# Altium project MotherBoard.PrjPcb
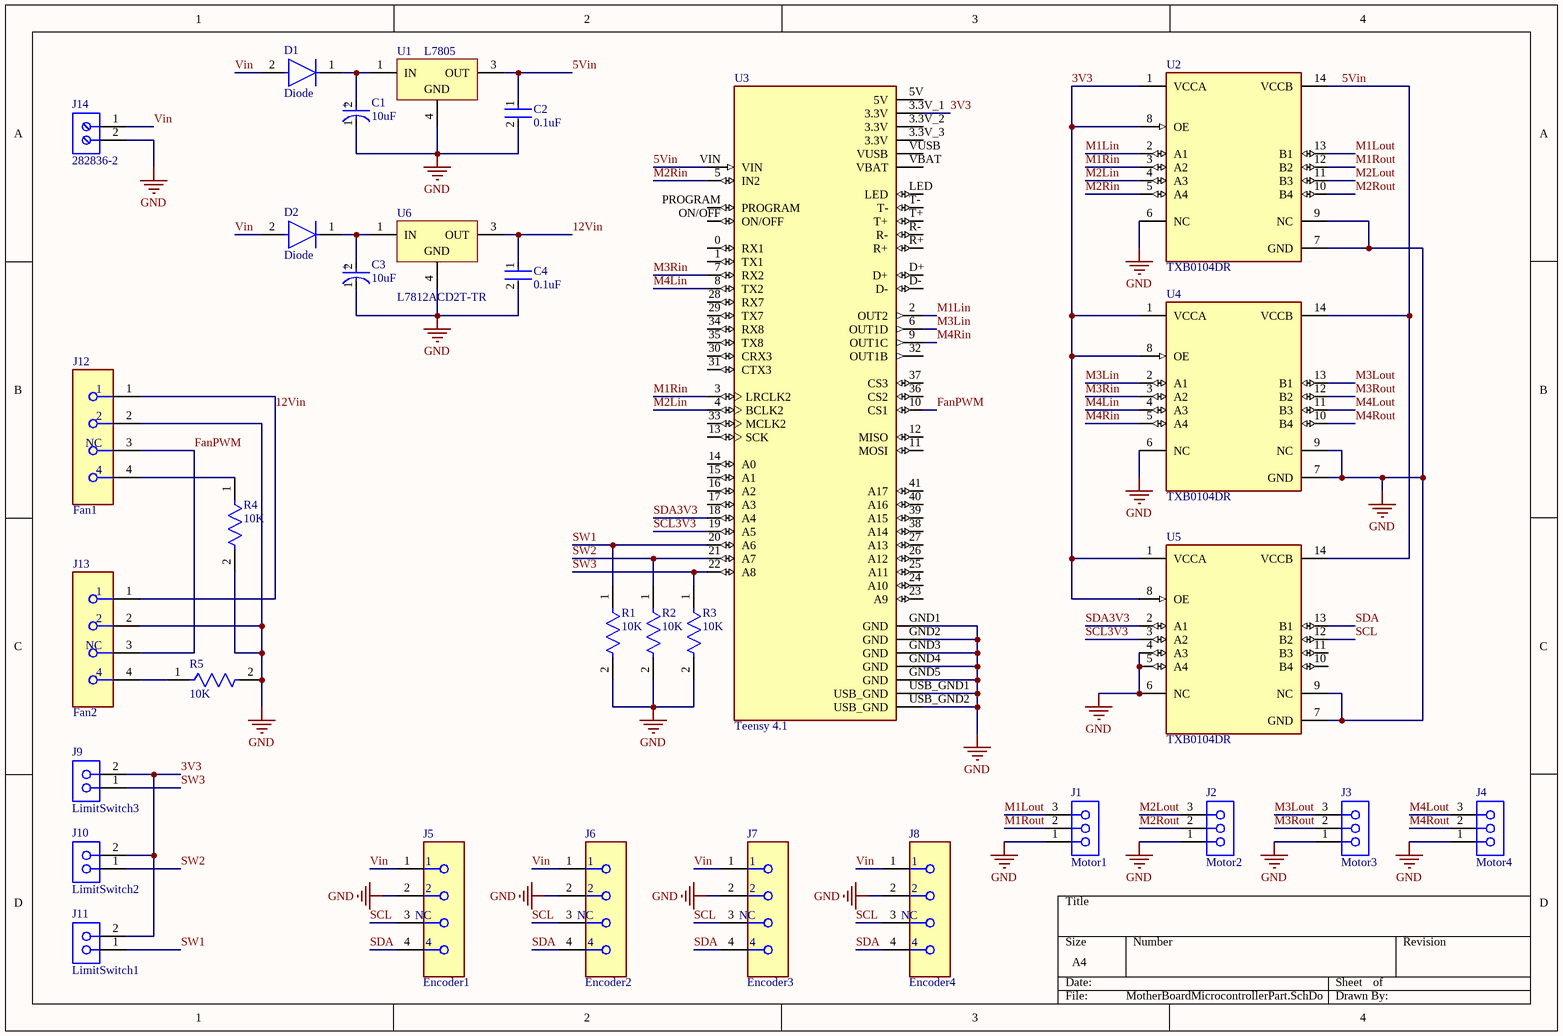
[diagram p0: MotherBoardMicrocontrollerPart.SchDoc]
1 sheet, 31 parts. Net scope: global (net labels, ports and power ports of the same name join across sheets).
Board file: MotherBoardPCB.PcbDoc

## Sheet MotherBoardMicrocontrollerPart.SchDoc
size A4; SheetNumber: 1; SheetTotal: 1

### Parts
C1  10uF  [FP-FKC-MFG]
C2  0.1uF  [FP-C322C104K5R5TA-MFG]
C3  10uF  [FP-FKC-MFG]
C4  0.1uF  [FP-C322C104K5R5TA-MFG]
D1  Diode  [FP-UF4007-MFG]
D2  Diode  [FP-UF4007-MFG]
J1  Motor1  [SMTC-BCS-103-X-S-TE]
J2  Motor2  [SMTC-BCS-103-X-S-TE]
J3  Motor3  [SMTC-BCS-103-X-S-TE]
J4  Motor4  [SMTC-BCS-103-X-S-TE]
J5  Encoder1  [FP-SSW-104-01-G-S-003-MFG]
J6  Encoder2  [FP-SSW-104-01-G-S-003-MFG]
J7  Encoder3  [FP-SSW-104-01-G-S-003-MFG]
J8  Encoder4  [FP-SSW-104-01-G-S-003-MFG]
J9  LimitSwitch3  [SMTC-SSW-102-02-X-S]
J10  LimitSwitch2  [SMTC-SSW-102-02-X-S]
J11  LimitSwitch1  [SMTC-SSW-102-02-X-S]
J12  Fan1  [FP-SSW-104-01-G-S-003-MFG]
J13  Fan2  [FP-SSW-104-01-G-S-003-MFG]
J14  282836-2  [TECO-282836-2_V]
R1  10K  [FP-RC3216-IPC_C]
R2  10K  [FP-RC3216-IPC_C]
R3  10K  [FP-RC3216-IPC_C]
R4  10K  [FP-RC3216-IPC_C]
R5  10K  [FP-RC3216-IPC_C]
U1  L7805  [TO-263_M]
U2  TXB0104DR  [FP-D0014A-MFG]
U3  Teensy 4.1  [MODULE_DEV-16771]
U4  TXB0104DR  [FP-D0014A-MFG]
U5  TXB0104DR  [FP-D0014A-MFG]
U6  L7812ACD2T-TR  [TO-263_M]

### Nets
GND: C1.1(C) C2.2 C3.1(C) C4.2 J1.1 J2.1 J3.1 J4.1 J5.2 J6.2 J7.2 J8.2 J12.2 J13.2 J14.2 R1.2 R2.2 R3.2 R4.2 R5.2 U1.4(GND) U2.6(NC) U2.7(GND) U2.9(NC) U3.GND1(GND) U3.GND2(GND) U3.GND3(GND) U3.GND4(GND) U3.GND5(GND) U3.USB_GND1(USB_GND) U3.USB_GND2(USB_GND) U4.6(NC) U4.7(GND) U4.9(NC) U5.4(A3) U5.5(A4) U5.6(NC) U5.7(GND) U5.9(NC) U6.4(GND)
3V3: J9.2 J10.2 J11.2 U2.1(VCCA) U2.8(OE) U3.3.3V_1(3.3V) U4.1(VCCA) U4.8(OE) U5.1(VCCA) U5.8(OE)
5Vin: C2.1 U1.3(OUT) U2.14(VCCB) U3.VIN U4.14(VCCB) U5.14(VCCB)
12Vin: C4.1 J12.1 J13.1 U6.3(OUT)
FanPWM: J12.3(NC) J13.3(NC) U3.10(CS1)
M1Lin: U2.2(A1) U3.2(OUT2)
M1Lout: J1.3 U2.13(B1)
M1Rin: U2.3(A2) U3.3(LRCLK2)
M1Rout: J1.2 U2.12(B2)
M2Lin: U2.4(A3) U3.4(BCLK2)
M2Lout: J2.3 U2.11(B3)
M2Rin: U2.5(A4) U3.5(IN2)
M2Rout: J2.2 U2.10(B4)
M3Lin: U3.6(OUT1D) U4.2(A1)
M3Lout: J3.3 U4.13(B1)
M3Rin: U3.7(RX2) U4.3(A2)
M3Rout: J3.2 U4.12(B2)
M4Lin: U3.8(TX2) U4.4(A3)
M4Lout: J4.3 U4.11(B3)
M4Rin: U3.9(OUT1C) U4.5(A4)
M4Rout: J4.2 U4.10(B4)
SCL: J5.3(NC) J6.3(NC) J7.3(NC) J8.3(NC) U5.12(B2)
SCL3V3: U3.19(A5) U5.3(A2)
SDA: J5.4 J6.4 J7.4 J8.4 U5.13(B1)
SDA3V3: U3.18(A4) U5.2(A1)
SW1: J11.1 R1.1 U3.20(A6)
SW2: J10.1 R2.1 U3.21(A7)
SW3: J9.1 R3.1 U3.22(A8)
Vin: D1.2(A) D2.2(A) J5.1 J6.1 J7.1 J8.1 J14.1
NetC1_2: C1.2(A) D1.1(C) U1.1(IN)
NetC3_2: C3.2(A) D2.1(C) U6.1(IN)
NetJ12_4: J12.4 R4.1
NetJ13_4: J13.4 R5.1

Not connected (* = marked no-connect by the designer): U3 0(RX1) 1(TX1) 3.3V_2(3.3V) 3.3V_3(3.3V) 5V 11(MOSI) 12(MISO) 13(SCK) 14(A0) 15(A1) 16(A2) 17(A3) 23(A9) 24(A10) 25(A11) 26(A12) 27(A13) 28(RX7) 29(TX7) 30(CRX3) 31(CTX3) 32(OUT1B) 33(MCLK2) 34(RX8) 35(TX8) 36(CS2) 37(CS3) 38(A14) 39(A15) 40(A16) 41(A17) D+ D- LED ON/OFF PROGRAM R+ R- T+ T- VBAT VUSB; U5 10(B4) 11(B3)

### Notes on the sheet
- (in symbol CMP-05427-000030-1) +

### Library data of the parts
C1 C3 = CMP-05427-000030-1: CAP ALUM 10UF 20% 50V SMD; Impedance: 1.52R; Ripple Current (AC): 85mA; Life (Hours): 2000Hour; Leakage Current: 3uA; Dielectric Material: Aluminium; Length: 5.8mm; Voltage Rating: 50V; Radiation Hardening: No; Max Operating Temperature: 105°C; REACH SVHC: No SVHC; Tolerance: 20%; RoHS Compliant: Yes; Case/Package: Radial; Height: 5.8mm; Voltage: 50V; Diameter: 5mm; Number of Pins: 2; Ripple Current: 85mA; Series: FK; Lead Free: Lead Free; Width: 6.5mm; ESR (Equivalent Series Resistance): 1.52R; Package Quantity: 1000; Construction: Cylindrical; Voltage Rating (DC): 50V; Packaging: Tape and Reel; Height - Seated (Max): 0.228inch; Contact Plating: Tin; Capacitance: 10uF; Min Operating Temperature: -55°C; Termination: SMD/SMT; Material: Aluminium; Mount: Surface Mount
C2 C4 = CMP-03020-034661-1: CAP CER 0.1UF 50V X7R RADIAL; Capacitance: 100nF; Dielectric Material: Ceramic; Dissipation Factor: 2.5%; Lead Length: 7mm; Tolerance: 10%; Lead Diameter: 0.51mm; Lead/Base Style: Formed Leads; Construction: RADIAL; RoHS Compliant: Yes; Voltage Rating (DC): 50V; Packaging: Bulk; Lead Free: Lead Free; Width: 0.125inch; Lead Pitch: 5.08mm; Voltage Rating: 50V; Number of Pins: 2; Radiation Hardening: No; Material: Ceramic; REACH SVHC: No SVHC; Height - Seated (Max): 0.26inch; Case/Package: Radial; Weight: 0.0625lb; Dielectric: X7R; Min Operating Temperature: -55°C; Voltage: 50V; Series: Golden Max™; Max Operating Temperature: 125°C; Height: 3.18mm; Termination: Radial; Length: 5.08mm; Depth: 3.18mm; Package Quantity: 500; Mount: Through Hole
D1 D2 = CMP-02540-000043-1: DIODE GEN PURP 1KV 1A DO204AL; Manufacturer: Vishay; Manufacturer Part Number: UF4007-E3/54; Max Junction Temp: +150°C; Max Repetitive Reverse Voltage: 1000V; Max Surge Forward Current: 30A; Capacitance: 17pF; Peak Reverse Current: 10uA; Value: 17pF; Package: UF4007; Height: 2.7mm; RoHS: TRUE; Device Class L3: Rectifier Diodes; Temperature Range Low: -55°C; Ipc Land Pattern Name: DIOPA1088W105L520D270; Temperature: -55°C to +150°C; Category: Diode; Device Class L2: Diodes; Device Class L1: Discrete Semiconductors; Digikey Description: DIODE GEN PURP 1KV 1A DO204AL; Octopart: https://octopart.com/uf4007-e3%2F54-vishay-42333894; Mouser Description: Rectifiers Vr/1000V Io/1A; ComponentLink2URL: http://www.vishay.com/docs/88755/uf4001.pdf; Lead Free: Yes; Temperature Range High: +150°C; Automotive: No; ComponentLink2Description: Datasheet; Forward Current: 1A
J1-J4 = CMP-1023-00006-1: Tiger Claw(TM) Pass-Through Socket, Vertical, -55 to 125 degC, 2.54 mm Pitch, 3-Pin, Female, RoHS; PartNumber: BCS-103-F-S-TE; Manufacturer: Samtec; Pitch: 2.54 mm; DatasheetVersion: F-214; Orientation: Vertical; ComponentLink2Description: Datasheet; ComponentLink3Description: Package Specification; ComponentLink1Description: Manufacturer URL; ComponentLink1URL: http://www.samtec.com; ComponentLink3URL: http://www.samtec.com/documents/webfiles/cpdf/BCS-1XX-XXX-X-XX-XXX-MKT.pdf; Temperature Range: -55 to 125 degC; RoHS: True; PackageReference: BCS-103-X-S-TE; PackageVersion: BV, 9/1991; ComponentLink2URL: http://www.samtec.com/documents/webfiles/pdf/BCS.PDF; PackageDescription: Box Connector Socket Strip; Mounting Technology: Through-hole
J5-J8 J12 J13 = CMP-02766-000072-1: CONN RCPT 4POS 0.1 GOLD PCB; Manufacturer: Samtec; Manufacturer Part Number: SSW-104-01-G-S-003; Conn Gender: Female; Is Female: yes; Voltage Rating: 655V; Current Rating: 4.7A; Conn Orientation: Vertical; Number Of Contacts: 4; Pitch: 2.54mm; Height: 8.64mm; Package: 0; Device Class L1: Connectors; Lead Free: Yes; Octopart: https://octopart.com/ssw-104-01-g-s-003-samtec-17456976; Temperature Range High: +125°C; Device Class L3: unset; ComponentLink2URL: http://suddendocs.samtec.com/catalog_english/ssw_th.pdf; Device Class L2: Headers and Wire Housings; Footprint Url: http://suddendocs.samtec.com/prints/ssw-s.pdf; Digikey Description: CONN RCPT 4POS 0.1 GOLD PCB; Number Of Rows: 1; Temperature Range Low: -55°C; Contact Material: Gold,Nickel; Automotive: No; ComponentLink2Description: Datasheet; Temperature: -55°C to +125°C; Category: Conn; RoHS: TRUE
J9-J11 = CMP-1023-00323-1: SQ Post Socket, Through-hole, Vertical, -55 to 105 degC, 2.54 mm Pitch, 2-Pin, Female, RoHS; Manufacturer: Samtec; PartNumber: SSW-102-02-T-S; Pitch: 2.54 mm; ComponentLink3Description: Package Specification; ComponentLink2Description: Datasheet; ComponentLink1Description: Manufacturer URL; PackageVersion: CA, 6/1987; DatasheetVersion: F-214; PackageDescription: Assembly, Socket Strip .016 X .031 Tail; ComponentLink2URL: http://www.samtec.com/documents/webfiles/pdf/SSW_TH.PDF; RoHS: True; ComponentLink3URL: http://www.samtec.com/documents/webfiles/cpdf/SSW-1XX-XX-XXX-X-XX-XXX-XX-MKT.pdf; ComponentLink1URL: http://www.samtec.com; PackageReference: SSW-102-02-X-S; Mounting Technology: Through-hole; Orientation: Vertical; Temperature Range: -55 to 105 degC
J14 = CMP-1684-00017-1: Female Header, Pitch 5 mm, 1 x 2 Position, Height 10 mm, Tail Length 3.5 mm, Rohs, Bulk; Manufacturer: TE Connectivity; Wire Gauge: 16-30AWG; Product Training Modules: Wire-to-BoardEurostyleTerminalBlocks; Clamp Material - Plating: Brass-NickelPlated; Voltage: 300V; Mating Orientation: HorizontalwithBoard; Current: 13.5A; Pitch: 0.197"(5.00mm); Screw Thread: M3; 3D Model: 282836-2.pdf; Other Names: 5ULV-02B / A98076; Dynamic Catalog: BuchananSeries; Number of Levels: 1; Torque - Screw: 0.68Nm(6Lb-In); Featured Product: EurostyleTerminalBlockConnectors; Positions Per Level: 2; Wire Termination: Screw-RisingCageClamp; Datasheet URL: http://www.te.com.cn/commerce/DocumentDelivery/DDEController?Action=showdoc&DocId=Catalog+Section%7F1308389_EUROSTYLE_TERMINAL_BLOCKS%7F0607%7Fpdf%7FEnglish%7FENG_CS_1308389_EUROSTYLE_TERMINAL_BLOCKS_0607.pdf%7F282836-2; Color: Green; Family: TerminalBlocks-WiretoBoard; RoHS Information: 282836-2StatementofCompliance; Standard Package: 300; Contact Material - Plating: Brass-TinPlated; Manufacturer URL: http://www.te.com; Housing Material: Polyamide(PA66),Nylon6/6; Features: Interlocking(Side); Package Description: Female Header, Pitch 5 mm, 1 x 2 Position, Height 10 mm, Tail Length 3.5 mm; Mounting Type: ThroughHole; Package Reference: THD; Packaging: Bulk; Series: Buchanan; Category: Connectors,Interconnects; Screw Material - Plating: Brass-NickelPlated
R1-R5 = CMP-13261-005388-1: Res Thick Film 1206 10kΩ 5% 0.25W ±100ppm/°C Molded SMD T/R; Resistance: 10kR; Voltage Rating (DC): 200V; Max Power Dissipation: 250mW; Case Code (Metric): 3216; Radiation Hardening: No; Contact Plating: Tin; Packaging: Tape and Reel; Case Code (Imperial): 1206; Composition: Thick Film; Height: 0.026inch; Features: Moisture Resistant; Temperature Coefficient: 100ppm/°C; Tolerance: 5%; Length: 0.126inch; Min Operating Temperature: -55°C; Depth: 1.6mm; Case/Package: 1206; Number of Terminations: 2; Width: 0.063inch; Lead Free: Lead Free; Military Standard: Not; Max Operating Temperature: 155°C
U1 = CMP-0244-00213-1: Positive Voltage Regulator, 3-Pin D2PAK, Tape and Reel; PackageReference: TO-263; ComponentLink2URL: http://www.st.com/internet/com/TECHNICAL_RESOURCES/TECHNICAL_LITERATURE/DATASHEET/CD00000444.pdf; PackageDescription: 3-Pin Transistor Outline Package 2.54 mm Pitch, 15.4 mm Lead Span (D2PAK); DatasheetVersion: 16/11/2011; ComponentLink2Description: Datasheet; ComponentLink1Description: Manufacturer URL; PackageVersion: 2011; ComponentLink1URL: http://www.st.com
U2 U4 U5 = CMP-04899-000021-1: IC TRNSLTR BIDIRECTIONAL 14SOIC; Manufacturer: Texas Instruments; V B Min: 1.65V; Min Supply Voltage: 1.2V; Nominal Supply Current: 3.5uA; V B Max: 5.5V; Number Of Inputs: 1; Data Rate: 100Mbits/s; Propagation Delay: 4ns; Standoff Height: 0.1mm; V A Max: 3.6V; Number Of Circuits: 4; Max Junction Temp: +150°C; Ambient Temperature Range Low: -40°C; Package: D0014A; Mouser Description: Translation - Voltage Levels 4-Bit Bi-directional V-Level Translator; V A Min: 1.2V; Height: 1.75mm; ComponentLink2URL: http://www.ti.com/lit/ds/symlink/txb0104.pdf; Temperature: -40°C to +85°C; Ambient Temperature Range High: +85°C; Device Class L3: Voltage Level Shifters; Number Of Outputs: 1; Manufacturer Part Number: TXB0104DR; Temperature Range High: +85°C; Digikey Description: IC TRNSLTR BIDIRECTIONAL 14SOIC; Category: IC; ComponentLink2Description: Datasheet; RoHS: TRUE; Temperature Range Low: -40°C; Octopart: https://octopart.com/txb0104dr-texas+instruments-5447502; Device Class L1: Integrated Circuits (ICs); Max Supply Voltage: 5.5V; Device Class L2: Logic ICs; Automotive: No; Lead Free: Yes
U3 = DEV-16771: RT1062 Teensy 4.1 i.MX ARM Cortex-M7 MPU Embedded Evaluation Board; MF: {'manufacturer': u'SparkFun Electronics'}; Value: *; MP: DEV-16771; Package: None; Price: None; Availability: Unavailable
U6 = CMP-0244-00180-1: Positive Voltage Regulator, 3-Pin D2PAK, Tape and Reel; ComponentLink2Description: Datasheet; ComponentLink2URL: http://www.st.com/internet/com/TECHNICAL_RESOURCES/TECHNICAL_LITERATURE/DATASHEET/CD00000444.pdf; ComponentLink1Description: Manufacturer URL; DatasheetVersion: 16/11/2011; ComponentLink1URL: http://www.st.com; PackageDescription: 3-Pin Transistor Outline Package 2.54 mm Pitch, 15.4 mm Lead Span (D2PAK); PackageVersion: 2011; PackageReference: TO-263